# Altium schematic sheet CF_FMC_DE.SchDoc
size Tabloid; DocumentNumber: 10; SheetNumber: 10; SheetTotal: 10; Sheet_Name: CF_FMC_DE; Size: 11x17
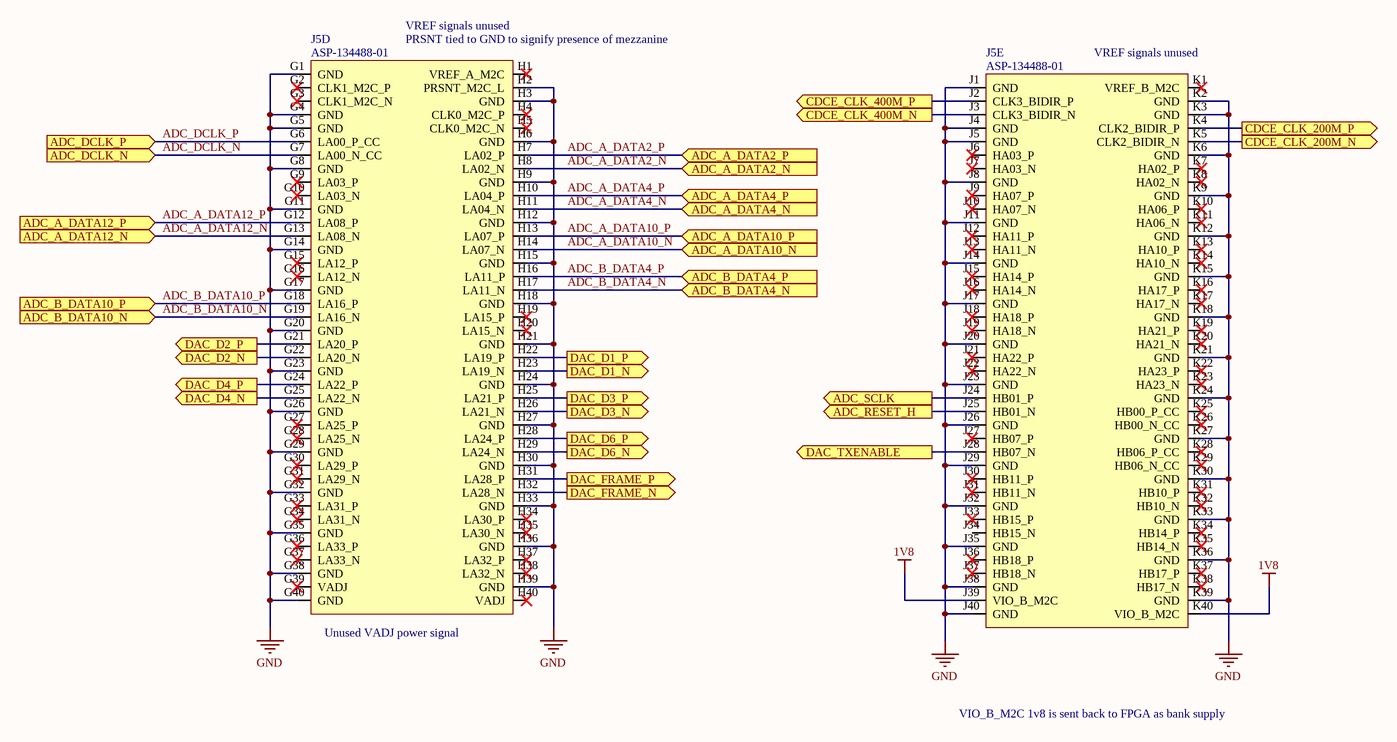
[diagram p0: CF_FMC_DE.SchDoc]

## Parts
J5  ASP-134488-01  [CONN_SAMTEC_ASP-134488-01]  (parts D,E of 5)

## Ports
ADC_A_DATA2_N (in), ADC_A_DATA2_P (in), ADC_A_DATA4_N (in), ADC_A_DATA4_P (in), ADC_A_DATA10_N (in), ADC_A_DATA10_P (in), ADC_A_DATA12_N (in), ADC_A_DATA12_P (in), ADC_B_DATA4_N (in), ADC_B_DATA4_P (in), ADC_B_DATA10_N (in), ADC_B_DATA10_P (in), ADC_DCLK_N (in), ADC_DCLK_P (in), ADC_RESET_H (out), ADC_SCLK (out), CDCE_CLK_200M_N (out), CDCE_CLK_200M_P (out), CDCE_CLK_400M_N (out), CDCE_CLK_400M_P (out), DAC_D1_N (out), DAC_D1_P (out), DAC_D2_N (out), DAC_D2_P (out), DAC_D3_N (out), DAC_D3_P (out), DAC_D4_N (out), DAC_D4_P (out), DAC_D6_N (out), DAC_D6_P (out), DAC_FRAME_N (out), DAC_FRAME_P (out), DAC_TXENABLE (out)

## Nets
1V8: J5.J39(VIO_B_M2C) J5.K40(VIO_B_M2C)
GND: J5.G1(GND) J5.G4(GND) J5.G5(GND) J5.G8(GND) J5.G11(GND) J5.G14(GND) J5.G17(GND) J5.G20(GND) J5.G23(GND) J5.G26(GND) J5.G29(GND) J5.G32(GND) J5.G35(GND) J5.G38(GND) J5.G40(GND) J5.H2(PRSNT_M2C_L) J5.H3(GND) J5.H6(GND) J5.H9(GND) J5.H12(GND) J5.H15(GND) J5.H18(GND) J5.H21(GND) J5.H24(GND) J5.H27(GND) J5.H30(GND) J5.H33(GND) J5.H36(GND) J5.H39(GND) J5.J1(GND) J5.J4(GND) J5.J5(GND) J5.J8(GND) J5.J11(GND) J5.J14(GND) J5.J17(GND) J5.J20(GND) J5.J23(GND) J5.J26(GND) J5.J29(GND) J5.J32(GND) J5.J35(GND) J5.J38(GND) J5.J40(GND) J5.K2(GND) J5.K3(GND) J5.K6(GND) J5.K9(GND) J5.K12(GND) J5.K15(GND) J5.K18(GND) J5.K21(GND) J5.K24(GND) J5.K27(GND) J5.K30(GND) J5.K33(GND) J5.K36(GND) J5.K39(GND)
ADC_A_DATA2_N: J5.H8(LA02_N) ; port ADC_A_DATA2_N
ADC_A_DATA2_P: J5.H7(LA02_P) ; port ADC_A_DATA2_P
ADC_A_DATA4_N: J5.H11(LA04_N) ; port ADC_A_DATA4_N
ADC_A_DATA4_P: J5.H10(LA04_P) ; port ADC_A_DATA4_P
ADC_A_DATA10_N: J5.H14(LA07_N) ; port ADC_A_DATA10_N
ADC_A_DATA10_P: J5.H13(LA07_P) ; port ADC_A_DATA10_P
ADC_A_DATA12_N: J5.G13(LA08_N) ; port ADC_A_DATA12_N
ADC_A_DATA12_P: J5.G12(LA08_P) ; port ADC_A_DATA12_P
ADC_B_DATA4_N: J5.H17(LA11_N) ; port ADC_B_DATA4_N
ADC_B_DATA4_P: J5.H16(LA11_P) ; port ADC_B_DATA4_P
ADC_B_DATA10_N: J5.G19(LA16_N) ; port ADC_B_DATA10_N
ADC_B_DATA10_P: J5.G18(LA16_P) ; port ADC_B_DATA10_P
ADC_DCLK_N: J5.G7(LA00_N_CC) ; port ADC_DCLK_N
ADC_DCLK_P: J5.G6(LA00_P_CC) ; port ADC_DCLK_P
ADC_RESET_H: J5.J25(HB01_N) ; port ADC_RESET_H
ADC_SCLK: J5.J24(HB01_P) ; port ADC_SCLK
CDCE_CLK_200M_N: J5.K5(CLK2_BIDIR_N) ; port CDCE_CLK_200M_N
CDCE_CLK_200M_P: J5.K4(CLK2_BIDIR_P) ; port CDCE_CLK_200M_P
CDCE_CLK_400M_N: J5.J3(CLK3_BIDIR_N) ; port CDCE_CLK_400M_N
CDCE_CLK_400M_P: J5.J2(CLK3_BIDIR_P) ; port CDCE_CLK_400M_P
DAC_D1_N: J5.H23(LA19_N) ; port DAC_D1_N
DAC_D1_P: J5.H22(LA19_P) ; port DAC_D1_P
DAC_D2_N: J5.G22(LA20_N) ; port DAC_D2_N
DAC_D2_P: J5.G21(LA20_P) ; port DAC_D2_P
DAC_D3_N: J5.H26(LA21_N) ; port DAC_D3_N
DAC_D3_P: J5.H25(LA21_P) ; port DAC_D3_P
DAC_D4_N: J5.G25(LA22_N) ; port DAC_D4_N
DAC_D4_P: J5.G24(LA22_P) ; port DAC_D4_P
DAC_D6_N: J5.H29(LA24_N) ; port DAC_D6_N
DAC_D6_P: J5.H28(LA24_P) ; port DAC_D6_P
DAC_FRAME_N: J5.H32(LA28_N) ; port DAC_FRAME_N
DAC_FRAME_P: J5.H31(LA28_P) ; port DAC_FRAME_P
DAC_TXENABLE: J5.J28(HB07_N) ; port DAC_TXENABLE

Not connected (* = marked no-connect by the designer): J5 G2(CLK1_M2C_P)* G3(CLK1_M2C_N)* G9(LA03_P)* G10(LA03_N)* G15(LA12_P)* G16(LA12_N)* G27(LA25_P)* G28(LA25_N)* G30(LA29_P)* G31(LA29_N)* G33(LA31_P)* G34(LA31_N)* G36(LA33_P)* G37(LA33_N)* G39(VADJ)* H1(VREF_A_M2C)* H4(CLK0_M2C_P)* H5(CLK0_M2C_N)* H19(LA15_P)* H20(LA15_N)* H34(LA30_P)* H35(LA30_N)* H37(LA32_P)* H38(LA32_N)* H40(VADJ)* J6(HA03_P)* J7(HA03_N)* J9(HA07_P)* J10(HA07_N)* J12(HA11_P)* J13(HA11_N)* J15(HA14_P)* J16(HA14_N)* J18(HA18_P)* J19(HA18_N)* J21(HA22_P)* J22(HA22_N)* J27(HB07_P)* J30(HB11_P)* J31(HB11_N)* J33(HB15_P)* J34(HB15_N) J36(HB18_P)* J37(HB18_N)* K1(VREF_B_M2C)* K7(HA02_P)* K8(HA02_N)* K10(HA06_P)* K11(HA06_N)* K13(HA10_P)* K14(HA10_N)* K16(HA17_P)* K17(HA17_N)* K19(HA21_P)* K20(HA21_N)* K22(HA23_P)* K23(HA23_N)* K25(HB00_P_CC)* K26(HB00_N_CC)* K28(HB06_P_CC)* K29(HB06_N_CC)* K31(HB10_P)* K32(HB10_N)* K34(HB14_P)* K35(HB14_N)* K37(HB17_P)* K38(HB17_N)*

## Notes on the sheet
- (near J5) VREF signals unused
- (near J5) PRSNT tied to GND to signify presence of mezzanine
- (near J5) Unused VADJ power signal
- VIO_B_M2C 1v8 is sent back to FPGA as bank supply
- Sheet Name
- Project Title
- Global Project
- Size
- Group
- Revision
- Date
- Sheet
- of
- Filename
- Designers

## Library data of the parts
J5 = CONN_SAMTEC_ASP-134488-01: CONN - VITA 57 MEZZ MALE (DAUGHTERBOARD) HIGH DENSITY - SMD-400; Voltage: 240VAC; Current: 1.8A; Mfg: Samtec; Power: *; Mfg Part Number: ASP-134488-01; HelpURL: http://suddendocs.samtec.com/prints/asp-134488-01-mkt.pdf; CreatedBy: Jonathan Bouchard; Temperature: -55 °C to +125 °C; Value: *; Precision: *; Package: SMD-400